# EAGLE design Simple (EAGLE 9.4.2)
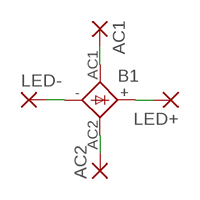
[diagram p0: schematic, sheet 1]

## Parts
AC1  WIREPAD-SMD2  [PAD-1.27X2.54]
AC2  WIREPAD-SMD2  [PAD-1.27X2.54]
B1  BRIDGEDBS  [DBS]
LED+  WIREPAD-SMD2  [PAD-1.27X2.54]
LED-  WIREPAD-SMD2  [PAD-1.27X2.54]

## Nets
N$1: B1.- LED-.P$1(P)
N$2: AC1.P$1(P) B1.AC1
N$3: B1.+ LED+.P$1(P)
N$4: AC2.P$1(P) B1.AC2

## Library data of the parts
AC1 AC2 LED+ LED- = Flamberm:WIREPAD-SMD2: SMD PAD
B1 = Flamberm:BRIDGE: GENERAL INSTRUMENT RECTIFIER

## Board
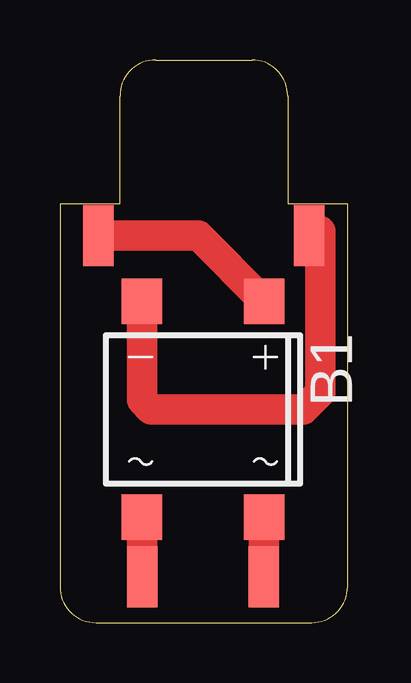
[diagram p1: board, top side]

Size 12 x 23.46 mm. Coordinates in mm from the lower left corner, seen from the top.
Outline: 2.5,17.46 0,17.46 0,1.5 arc90 1.5,0 10.5,0 arc90 12,1.5 12,17.46 9.5,17.46 9.5,21.96 arc90 8,23.46 4,23.46 arc90 2.5,21.96 2.5,17.46
Copper layers (1*16): Top 0.035mm / dielectric 1.5mm / Bottom 0.035mm
Design rules "EagleDesignRules": minimum track width 0.25mm, minimum drill 0.3mm, track to track 0.25mm, track to pad 0.25mm, pad to pad 0.25mm, via to via 0.25mm, smd to smd 0.25mm, copper to edge 0.5mm, drill to drill 0.5mm, minimum pad ring 10mil, minimum via ring 8mil, stop-mask expansion 4mil, vias tented up to drill 0mil, thermal gap 0.25mm

### Footprints (pad centres in the part's own frame; a part is rotated, then mirrored left to right if it is on the bottom)
PAD-1.27X2.54 = smd 2.54 x 1.27: P$1 0,0
DBS = smd 1.7 x 1.9: + -2.55,-4.5; - 2.55,-4.5; AC1 -2.55,4.5; AC2 2.55,4.5

### Placement (x,y rotation side)
AC1  8.51,1.91 90 top
AC2  3.43,1.91 90 top
B1  5.97,8.89 180 top
LED+  1.6,16.13 90 top
LED-  10.4,16.13 90 top

### Tracks (layer width: path | path; a pad name or v marks a point on that pad's centre or on a via)
N$1
  Top 1.27: B1.- 3.42,9.28 3.81,8.89 10.16,8.89 10.87,9.59 10.87,16.32 10.6,16.32 LED-.P$1
N$2
  Top 1.27: AC1.P$1 B1.AC1
N$3
  Top 1.27: B1.+ 5.78,16.13 LED+.P$1
N$4
  Top 1.27: AC2.P$1 B1.AC2